# Altium project 2S_BatteryPack_V100.PrjPcb
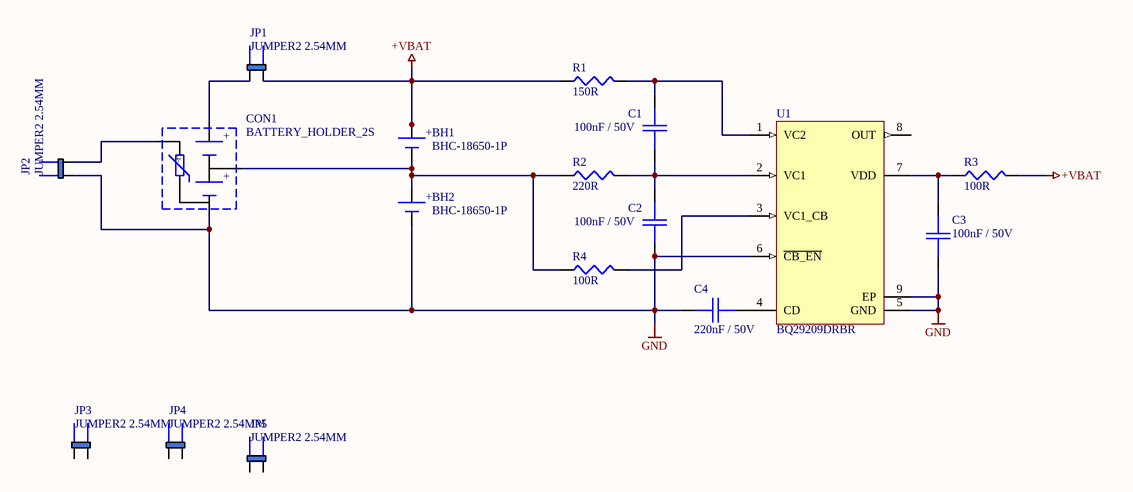
[diagram p0: 2S1P_BatteryPack_V100.SchDoc]
1 sheet, 17 parts. Net scope: global (net labels, ports and power ports of the same name join across sheets).
Board file: 2S_BatteryPack_V100.PcbDoc

## Sheet 2S1P_BatteryPack_V100.SchDoc
size A4; SheetNumber: 1; SheetTotal: 1

### Parts
BH1  BHC-18650-1P  [18650_HOLDER]
BH2  BHC-18650-1P  [18650_HOLDER]
C1  100nF / 50V  [0805_C]
C2  100nF / 50V  [0805_C]
C3  100nF / 50V  [0805_C]
C4  220nF / 50V  [0805_C]
CON1  BATTERY_HOLDER_2S  [MOLEX-53253-0470]
JP1  JUMPER2 2.54MM  [JUMPER_5]
JP2  JUMPER2 2.54MM  [JUMPER_5]
JP3  JUMPER2 2.54MM  [JUMPER_5]
JP4  JUMPER2 2.54MM  [JUMPER_5]
JP5  JUMPER2 2.54MM  [JUMPER_5]
R1  150R  [0805]
R2  220R  [0805]
R3  100R  [0805]
R4  100R  [0805]
U1  BQ29209DRBR  [VSON-8]

### Nets
+VBAT: BH1.1 JP1.2 R1.1 R3.1
GND: BH2.2 C2.2 C3.1 C4.1 CON1.3 JP2.1 U1.5(GND) U1.6(~{CB_EN}) U1.9(EP)
NetBH1_2: BH1.2 BH2.1 CON1.2 R2.1 R4.1
NetC1_1: C1.1 R1.2 U1.1(VC2)
NetC1_2: C1.2 C2.1 R2.2 U1.2(VC1)
NetC3_2: C3.2 R3.2 U1.7(VDD)
NetC4_2: C4.2 U1.4(CD)
NetCON1_1: CON1.1 JP1.1
NetCON1_4: CON1.4 JP2.2
NetR4_2: R4.2 U1.3(VC1_CB)

Not connected (* = marked no-connect by the designer): JP3 1 2; JP4 1 2; JP5 1 2; U1 8(OUT)

### Notes on the sheet
- (in symbol 380) +; -t°
- (in symbol 413) +

### Library data of the parts
BH1 BH2 = 413: 18650 Battery Cell Holder THT; Azonosító: 413; Part Number: BHC-18650-1P; Category: Accessories; Subcategory: ACCE_Battery; Supplier 1: HESTORE; Supplier 1 order number: 100.373.04; Help URL: https://www.hestore.hu/prod_getfile.php?id=9225
C1-C3 = 149: 100nF 50V X7R; Part Number: SMD0805-100nF-50V; Azonosító: 149; Category: Passives; Subcategory: PASS_Capacitor; Supplier 1: HESTORE; Supplier 1 order number: 100.011.22
C4 = 150: 220nF 50V Y5V; Part Number: SMD0805-220nF-50V; Azonosító: 150; Category: Passives; Subcategory: PASS_Capacitor; Supplier 1: HESTORE; Supplier 1 order number: 100.200.75
CON1 = 380: 2S Battery with NTC thermistor; Azonosító: 380; Part Number: BATTERY_HOLDER_2S; Category: Accessories; Subcategory: ACCE_Battery; Supplier 1: MOUSER; Supplier 1 order number: 538-53253-0470
JP1-JP5 = 246: Azonosító: 246; Part Number: JUMPER2 2.54MM; Category: Connectors; Subcategory: CONN_Other; Supplier 1: FARNELL; Supplier 1 order number: 2356153
R1 = 46: 150R 0805 0.125W 5%; Part Number: SMD0805-150R 5%; Azonosító: 46; Category: Passives; Subcategory: PASS_Resistor; Supplier 1: HESTORE; Supplier 1 order number: 100.011.49
R2 = 47: 220R 0805 0.125W 5%; Part Number: SMD0805-220R 5%; Azonosító: 47; Category: Passives; Subcategory: PASS_Resistor; Supplier 1: HESTORE; Supplier 1 order number: 100.011.62
R3 R4 = 45: 100R 0805 0.125W 5%; Part Number: SMD0805-100R 5%; Azonosító: 45; Category: Passives; Subcategory: PASS_Resistor; Supplier 1: HESTORE; Supplier 1 order number: 100.449.24
U1 = 367: Voltage Protection with Automatic Cell Balance for 2-Cell Li-Ion Batteries, OVP=4.3 V, -40 to 85 degC, 8-pin SON (DRB), Green (RoHS & no Sb/Br); Manufacturer: Texas Instruments; SubFamily: Lithium Ion Protection; Lead Acid: N; Azonosító: 367; PackageReference: DRB0008B; Li-Ion: N; PackageVersion: revK, Jun-2012; PartNumber: BQ29209DRBR; Eco-Plan: Green (RoHS & no Sb/Br); DatasheetVersion: SLUSA52A; PackageDescription: 8-Pin Plastic Small Outline No-Lead, 3 x 3 x 1 mm Body, 0.65 mm Pitch, Exposed Pad; Li-Polymer: N; Mounting Technology: Surface Mount; Over Voltage Protection: N; NiCd: N; ComponentLink1URL: http://www.ti.com/general/docs/lit/getliterature.tsp?genericPartNumber=BQ29209&fileType=pdf; ComponentLink1Description: Datasheet; NiMH: N; Part Number: BQ29209DRBR; Category: Semiconductors; Subcategory: IC_Power; Supplier 1: MOUSER; Supplier 1 order number: 595-BQ29209DRBR; Help URL: https://www.ti.com/lit/ds/symlink/bq29209.pdf?ts=1707500814876&ref_url=https%253A%252F%252Fwww.ti.com%252Fproduct%252Fde-de%252FBQ29209